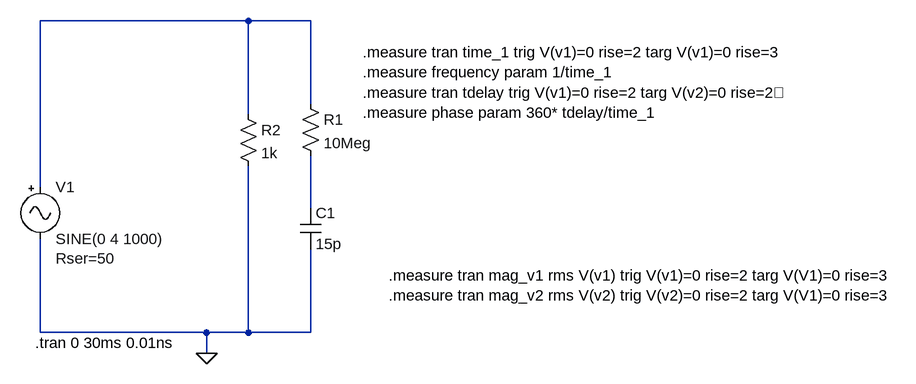
[diagram p0: schematic diy-vna2.asc]
diy-vna2.asc, the LTspice schematic file:
Version 4
SHEET 1 1200 680
WIRE 176 48 -144 48
WIRE 272 48 176 48
WIRE 272 176 272 48
WIRE 176 192 176 48
WIRE -144 304 -144 48
WIRE 272 336 272 256
WIRE -144 528 -144 384
WIRE 112 528 -144 528
WIRE 176 528 176 272
WIRE 176 528 112 528
WIRE 272 528 272 400
WIRE 272 528 176 528
WIRE 112 560 112 528
FLAG 112 560 0
SYMBOL Misc/signal -144 288 R0
WINDOW 39 24 126 Left 2
SYMATTR SpiceLine Rser=50
SYMATTR InstName V1
SYMATTR Value SINE(0 4 1000)
SYMBOL res 256 160 R0
SYMATTR InstName R1
SYMATTR Value 10Meg
SYMBOL cap 256 336 R0
SYMATTR InstName C1
SYMATTR Value 15p
SYMBOL res 160 176 R0
SYMATTR InstName R2
SYMATTR Value 1k
TEXT -152 544 Left 2 !.tran 0 30ms 0.01ns
TEXT 352 96 Left 2 !.measure tran time_1 trig V(v1)=0 rise=2 targ V(v1)=0 rise=3\n.measure frequency param 1/time_1\n.measure tran tdelay trig V(v1)=0 rise=2 targ V(v2)=0 rise=2\n.measure phase param 360* tdelay/time_1
TEXT 392 440 Left 2 !.measure tran mag_v1 rms V(v1) trig V(v1)=0 rise=2 targ V(V1)=0 rise=3\n.measure tran mag_v2 rms V(v2) trig V(v2)=0 rise=2 targ V(V1)=0 rise=3

The netlist it stands for:
* diy-vna2.asc
V1 N001 0 SINE(0 4 1000) Rser=50
R1 N001 N002 10Meg
C1 N002 0 15p
R2 N001 0 1k
.tran 0 30ms 0.01ns
.measure tran time_1 trig V(v1)=0 rise=2 targ V(v1)=0 rise=3
.measure frequency param 1/time_1
.measure tran tdelay trig V(v1)=0 rise=2 targ V(v2)=0 rise=2
.measure phase param 360* tdelay/time_1
.measure tran mag_v1 rms V(v1) trig V(v1)=0 rise=2 targ V(V1)=0 rise=3
.measure tran mag_v2 rms V(v2) trig V(v2)=0 rise=2 targ V(V1)=0 rise=3
.backanno
.end